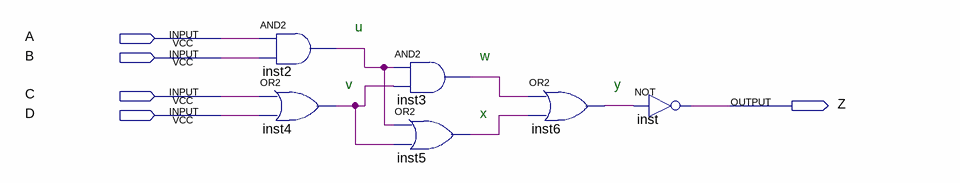
[diagram p0: schematic sheet]
// Quartus schematic question.bdf as structural Verilog: 6 symbols, 5 pins
module question (
  input  A,
  input  B,
  input  C,
  input  D,
  output Z
);

  wire inst2_out, inst3_out, inst4_out, inst5_out, inst6_out;

  and inst2 (inst2_out, A, B);
  or inst4 (inst4_out, C, D);
  and inst3 (inst3_out, inst2_out, inst4_out);
  or inst5 (inst5_out, inst2_out, inst4_out);
  or inst6 (inst6_out, inst3_out, inst5_out);
  not inst (Z, inst6_out);

  // Notes on the sheet:
  //   u
  //   w
  //   v
  //   y
  //   x
endmodule
